# EAGLE schematic Stromlaufplan_v21 (EAGLE 9.7.0)
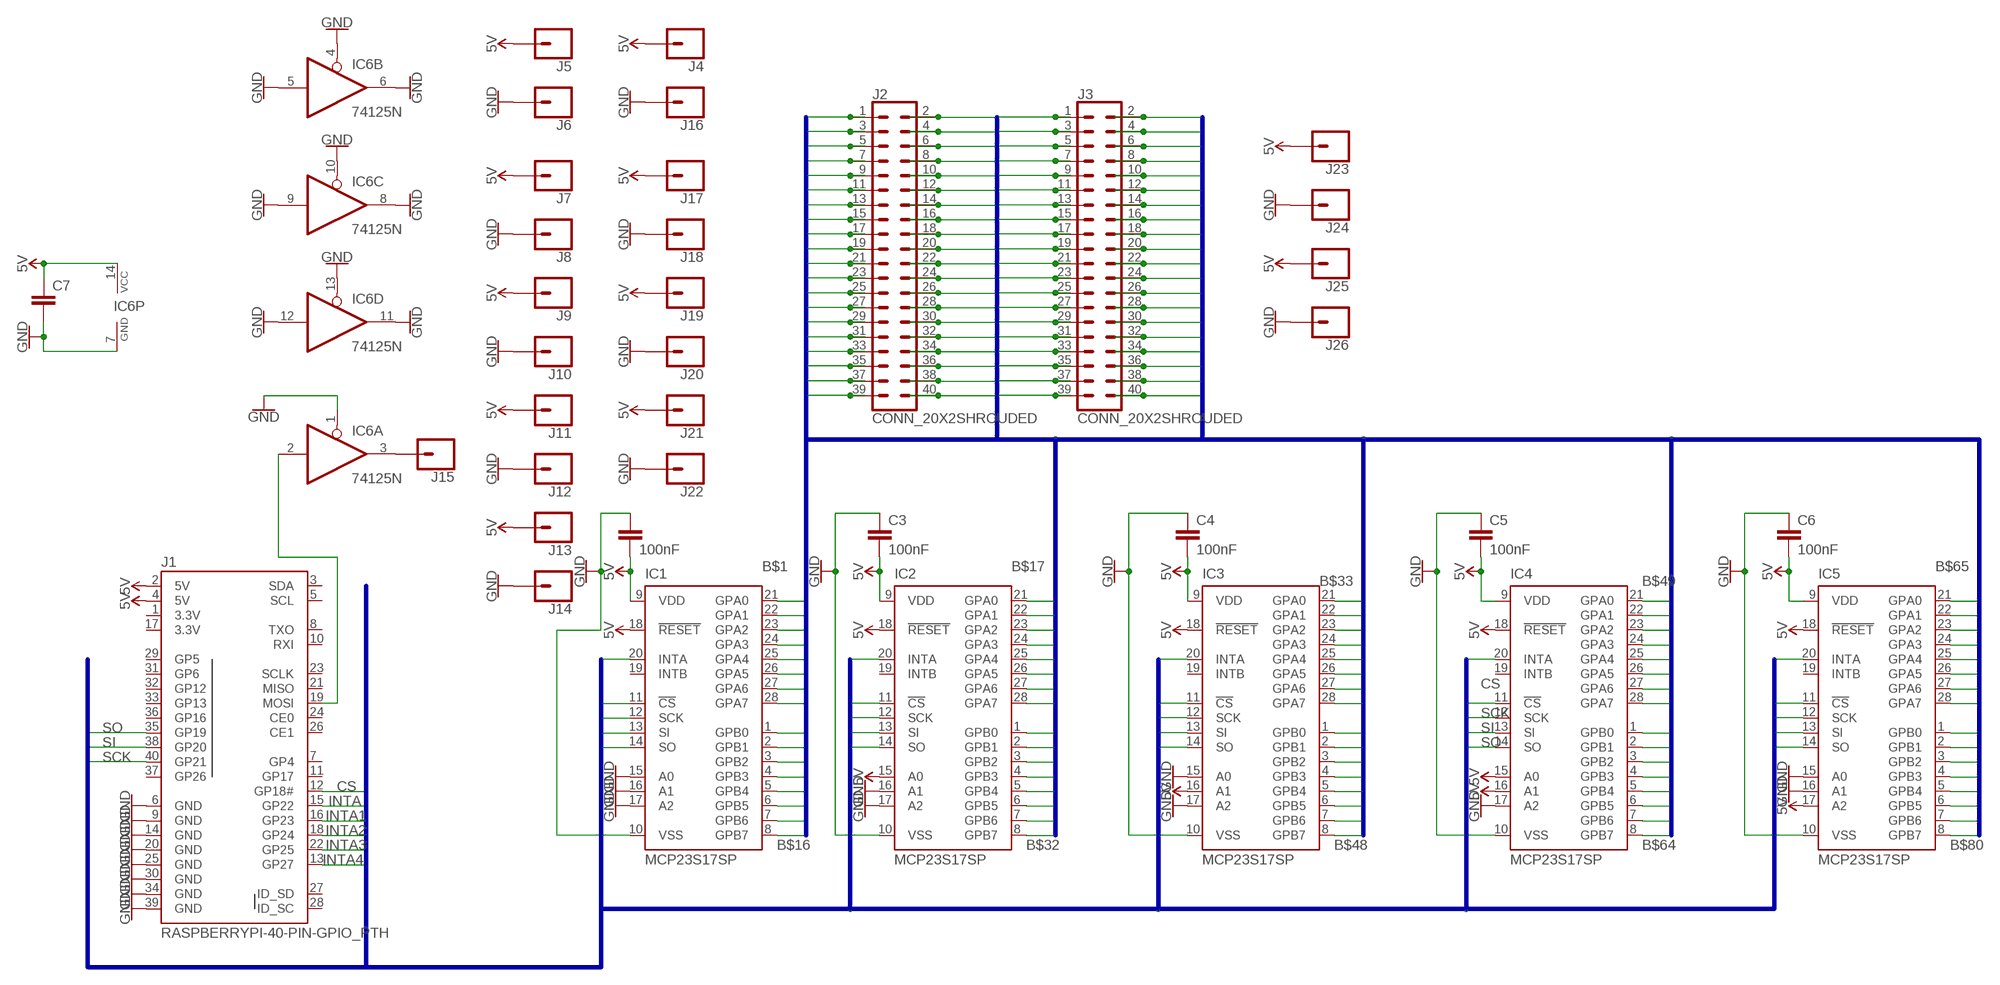
[diagram p0: schematic, sheet 1]

## Parts
C2  100nF  0.33UF/330NF-0805-50V-10%  [0805]
C3  100nF  0.33UF/330NF-0805-50V-10%  [0805]
C4  100nF  0.33UF/330NF-0805-50V-10%  [0805]
C5  100nF  0.33UF/330NF-0805-50V-10%  [0805]
C6  100nF  0.33UF/330NF-0805-50V-10%  [0805]
C7  100nF  0.33UF/330NF-0805-50V-10%  [0805]
IC1  MCP23S17SP  [DIL28-3]
IC2  MCP23S17SP  [DIL28-3]
IC3  MCP23S17SP  [DIL28-3]
IC4  MCP23S17SP  [DIL28-3]
IC5  MCP23S17SP  [DIL28-3]
IC6  74125N  [DIL14]
J1  RASPBERRYPI-40-PIN-GPIO_PTH  [2X20_SHROUDED]
J2  CONN_20X2SHROUDED  [2X20_SHROUDED]
J3  CONN_20X2SHROUDED  [2X20_SHROUDED]
J4  CONN_01PTH_NO_SILK_YES_STOP  [1X01_NO_SILK]
J5  CONN_01  [1X01]
J6  CONN_01  [1X01]
J7  CONN_01PTH_NO_SILK_YES_STOP  [1X01_NO_SILK]
J8  CONN_01PTH_NO_SILK_YES_STOP  [1X01_NO_SILK]
J9  CONN_01PTH_NO_SILK_YES_STOP  [1X01_NO_SILK]
J10  CONN_01PTH_NO_SILK_YES_STOP  [1X01_NO_SILK]
J11  CONN_01PTH_NO_SILK_YES_STOP  [1X01_NO_SILK]
J12  CONN_01PTH_NO_SILK_YES_STOP  [1X01_NO_SILK]
J13  CONN_01PTH_NO_SILK_YES_STOP  [1X01_NO_SILK]
J14  CONN_01PTH_NO_SILK_YES_STOP  [1X01_NO_SILK]
J15  CONN_01PTH_NO_SILK_YES_STOP  [1X01_NO_SILK]
J16  CONN_01PTH_NO_SILK_YES_STOP  [1X01_NO_SILK]
J17  CONN_01PTH_NO_SILK_YES_STOP  [1X01_NO_SILK]
J18  CONN_01PTH_NO_SILK_YES_STOP  [1X01_NO_SILK]
J19  CONN_01PTH_NO_SILK_YES_STOP  [1X01_NO_SILK]
J20  CONN_01PTH_NO_SILK_YES_STOP  [1X01_NO_SILK]
J21  CONN_01PTH_NO_SILK_YES_STOP  [1X01_NO_SILK]
J22  CONN_01PTH_NO_SILK_YES_STOP  [1X01_NO_SILK]
J23  CONN_01PTH_NO_SILK_YES_STOP  [1X01_NO_SILK]
J24  CONN_01PTH_NO_SILK_YES_STOP  [1X01_NO_SILK]
J25  CONN_01PTH_NO_SILK_YES_STOP  [1X01_NO_SILK]
J26  CONN_01PTH_NO_SILK_YES_STOP  [1X01_NO_SILK]

## Nets
5V: C2.2 C3.2 C4.2 C5.2 C6.2 C7.1 IC1.9(VDD) IC1.18(!RESET) IC2.9(VDD) IC2.15(A0) IC2.18(!RESET) IC3.9(VDD) IC3.16(A1) IC3.18(!RESET) IC4.9(VDD) IC4.15(A0) IC4.16(A1) IC4.18(!RESET) IC5.9(VDD) IC5.17(A2) IC5.18(!RESET) IC6.14(P:VCC) J1.2(5V) J1.4(5V) J4.1 J5.1 J7.1 J9.1 J11.1 J13.1 J17.1 J19.1 J21.1 J23.1 J25.1
B$1: IC1.21(GPA0) J2.1
B$2: IC1.22(GPA1) J2.2
B$3: IC1.23(GPA2) J2.3
B$4: IC1.24(GPA3) J2.4
B$5: IC1.25(GPA4) J2.5
B$6: IC1.26(GPA5) J2.6
B$7: IC1.27(GPA6) J2.7
B$8: IC1.28(GPA7) J2.8
B$9: IC1.1(GPB0) J2.9
B$10: IC1.2(GPB1) J2.10
B$11: IC1.3(GPB2) J2.11
B$12: IC1.4(GPB3) J2.12
B$13: IC1.5(GPB4) J2.13
B$14: IC1.6(GPB5) J2.14
B$15: IC1.7(GPB6) J2.15
B$16: IC1.8(GPB7) J2.16
B$17: IC2.21(GPA0) J2.17
B$18: IC2.22(GPA1) J2.18
B$19: IC2.23(GPA2) J2.19
B$20: IC2.24(GPA3) J2.20
B$21: IC2.25(GPA4) J2.21
B$22: IC2.26(GPA5) J2.22
B$23: IC2.27(GPA6) J2.23
B$24: IC2.28(GPA7) J2.24
B$25: IC2.1(GPB0) J2.25
B$26: IC2.2(GPB1) J2.26
B$27: IC2.3(GPB2) J2.27
B$28: IC2.4(GPB3) J2.28
B$29: IC2.5(GPB4) J2.29
B$30: IC2.6(GPB5) J2.30
B$31: IC2.7(GPB6) J2.31
B$32: IC2.8(GPB7) J2.32
B$33: IC3.21(GPA0) J2.33
B$34: IC3.22(GPA1) J2.34
B$35: IC3.23(GPA2) J2.35
B$36: IC3.24(GPA3) J2.36
B$37: IC3.25(GPA4) J2.37
B$38: IC3.26(GPA5) J2.38
B$39: IC3.27(GPA6) J2.39
B$40: IC3.28(GPA7) J2.40
B$41: IC3.1(GPB0) J3.1
B$42: IC3.2(GPB1) J3.2
B$43: IC3.3(GPB2) J3.3
B$44: IC3.4(GPB3) J3.4
B$45: IC3.5(GPB4) J3.5
B$46: IC3.6(GPB5) J3.6
B$47: IC3.7(GPB6) J3.7
B$48: IC3.8(GPB7) J3.8
B$49: IC4.21(GPA0) J3.9
B$50: IC4.22(GPA1) J3.10
B$51: IC4.23(GPA2) J3.11
B$52: IC4.24(GPA3) J3.12
B$53: IC4.25(GPA4) J3.13
B$54: IC4.26(GPA5) J3.14
B$55: IC4.27(GPA6) J3.15
B$56: IC4.28(GPA7) J3.16
B$57: IC4.1(GPB0) J3.17
B$58: IC4.2(GPB1) J3.18
B$59: IC4.3(GPB2) J3.19
B$60: IC4.4(GPB3) J3.20
B$61: IC4.5(GPB4) J3.21
B$62: IC4.6(GPB5) J3.22
B$63: IC4.7(GPB6) J3.23
B$64: IC4.8(GPB7) J3.24
B$65: IC5.21(GPA0) J3.25
B$66: IC5.22(GPA1) J3.26
B$67: IC5.23(GPA2) J3.27
B$68: IC5.24(GPA3) J3.28
B$69: IC5.25(GPA4) J3.29
B$70: IC5.26(GPA5) J3.30
B$71: IC5.27(GPA6) J3.31
B$72: IC5.28(GPA7) J3.32
B$73: IC5.1(GPB0) J3.33
B$74: IC5.2(GPB1) J3.34
B$75: IC5.3(GPB2) J3.35
B$76: IC5.4(GPB3) J3.36
B$77: IC5.5(GPB4) J3.37
B$78: IC5.6(GPB5) J3.38
B$79: IC5.7(GPB6) J3.39
B$80: IC5.8(GPB7) J3.40
CS: IC1.11(!CS) IC2.11(!CS) IC3.11(!CS) IC4.11(!CS) IC5.11(!CS) J1.12(GP18#)
GND: C2.1 C3.1 C4.1 C5.1 C6.1 C7.2 IC1.10(VSS) IC1.15(A0) IC1.16(A1) IC1.17(A2) IC2.10(VSS) IC2.16(A1) IC2.17(A2) IC3.10(VSS) IC3.15(A0) IC3.17(A2) IC4.10(VSS) IC4.17(A2) IC5.10(VSS) IC5.15(A0) IC5.16(A1) IC6.1(A:OE) IC6.4(B:OE) IC6.5(B:I) IC6.6(B:O) IC6.7(P:GND) IC6.8(C:O) IC6.9(C:I) IC6.10(C:OE) IC6.11(D:O) IC6.12(D:I) IC6.13(D:OE) J1.6(GND) J1.9(GND) J1.14(GND) J1.20(GND) J1.25(GND) J1.30(GND) J1.34(GND) J1.39(GND) J6.1 J8.1 J10.1 J12.1 J14.1 J16.1 J18.1 J20.1 J22.1 J24.1 J26.1
INTA: IC1.20(INTA) J1.15(GP22)
INTA1: IC2.20(INTA) J1.16(GP23)
INTA2: IC3.20(INTA) J1.18(GP24)
INTA3: IC4.20(INTA) J1.22(GP25)
INTA4: IC5.20(INTA) J1.13(GP27)
N$1: IC6.2(A:I) J1.19(MOSI)
N$2: IC6.3(A:O) J15.1
SCK: IC1.12(SCK) IC2.12(SCK) IC3.12(SCK) IC4.12(SCK) IC5.12(SCK) J1.40(GP21)
SI: IC1.13(SI) IC2.13(SI) IC3.13(SI) IC4.13(SI) IC5.13(SI) J1.38(GP20)
SO: IC1.14(SO) IC2.14(SO) IC3.14(SO) IC4.14(SO) IC5.14(SO) J1.35(GP19)
Unconnected: IC1.19(INTB) IC2.19(INTB) IC3.19(INTB) IC4.19(INTB) IC5.19(INTB) J1.3(SDA) J1.5(SCL) J1.7(GP4) J1.8(TXO) J1.10(RXI) J1.11(GP17) J1.21(MISO) J1.23(SCLK) J1.24(CE0) J1.26(CE1) J1.27(ID_SD) J1.28(ID_SC) J1.29(GP5) J1.31(GP6) J1.32(GP12) J1.33(GP13) J1.36(GP16) J1.37(GP26)

## Buses
CS,INTA,INTA1,INTA2,INTA3,INTA4,INTB,SCK,SI,SO,VDD,VSS
B$1,B$2,B$3,B$4,B$5,B$6,B$7,B$8,B$9,B$10,B$11,B$12,B$13,B$14,B$15,B$16,B$17,B$18,B$19,B$20,B$21,B$22,B$23,B$24,B$25,B$26,B$27,B$28,B$29,B$30,B$31,B$32,B$33,B$34,B$35,B$36,B$37,B$38,B$39,B$40,B$41,B$42,B$43,B$44,B$45,B$46,B$47,B$48,B$49,B$50,B$51,B$52,B$53,B$54,B$55,B$56,B$57,B$58,B$59,B$60,B$61,B$62,B$63,B$64,B$65,B$66,B$67,B$68,B$69,B$70,B$71,B$72,B$73,B$74,B$75,B$76,B$77,B$78,B$79,B$80

## Power pins joined to a net without a drawn wire
3.3V: J1.1(3.3V) J1.17(3.3V)

## Library data of the parts
C2-C7 = SparkFun-Capacitors:0.33UF/330NF: 0.33µF/330nF ceramic capacitors A capacitor is a passive two-terminal electrical component used to store electrical energy temporarily in an electric field.; PROD_ID: CAP-08469; VALUE: 0.33µF
IC1-IC5 = microchip:MCP23S17: http://ww1.microchip.com/downloads/en/DeviceDoc/21952a.pdf Source: http://ww1.microchip.com/downloads/en/DeviceDoc/21952a.pdf; MF: MICROCHIP; MPN: MCP23S17-E/SP; OC_FARNELL: 1292238; OC_NEWARK: 31K2951
IC6 = 74xx-eu:74*125: Quad bus BUFFER, 3-state
J1 = SparkFun-Connectors_Ladestation:RASPBERRYPI-40-PIN-GPIO: Raspberry Pi GPIO Header 2x20 pin connector, as found on B, B+, A+ models. Both shrouded PTH and SMT versions available. SparkFun Products: GPIO Shrouded Header <https://www.sparkfun.com/products/13054>- PTH SparkFun Pi Wedge (Preassembled) <https://www.sparkfun.com/products/13717>; PROD_ID: CONN-12263; SF_ID: PRT-13054
J2 J3 = SparkFun-Connectors_Ladestation:CONN_20X2: Multi connection point. Often used as Generic Header-pin footprint for 0.1 inch spaced/style header connections On any of the 0.1 inch spaced packages, you can populate with these: Break Away Headers - Straight <https://www.sparkfun.com/products/116> (PRT-00116) Break Away Male Headers - Right Angle <https://www.sparkfun.com/products/553> (PRT-00553) Female Headers <https://www.sparkfun.com/products/115> (PRT-00115) Break Away Headers - Machine Pin <https://www.sparkfun.com/products/117> (PRT-00117) Break Away Female Headers - Swiss Machine Pin <https://www.sparkfun.com/products/743> (PRT-00743); PROD_ID: CONN-12263; SF_ID: CONN-12263
J4-J26 = SparkFun-Connectors_Ladestation:CONN_01: Single connection point. Often used as Generic Header-pin footprint for 0.1 inch spaced/style header connections On any of the 0.1 inch spaced packages, you can populate with these: Break Away Headers - Straight <https://www.sparkfun.com/products/116> (PRT-00116) Break Away Male Headers - Right Angle <https://www.sparkfun.com/products/553> (PRT-00553) Female Headers <https://www.sparkfun.com/products/115> (PRT-00115) Break Away Headers - Machine Pin <https://www.sparkfun.com/products/117> (PRT-00117) Break Away Female Headers - Swiss Machine Pin <https://www.sparkfun.com/products/743> (PRT-00743) This device is also useful as a general connection point to wire up your design to another part of your project. Our various solder wires solder well into these plated through hole pads. Hook-Up Wire - Assortment (Stranded, 22 AWG) <https://www.sparkfun.com/products/11375> (PRT-11375) Hook-Up Wire - Assortment (Solid Core, 22 AWG) <https://www.sparkfun.com/products/11367> (PRT-11367) View the entire wire category on our website here <https://www.sparkfun.com/categories/141> Special notes: SMTSO-256-ET is a "flush mount" nut for a 4-40 screw. We mostly use this on specialty testbeds; it is a nice way to connect hardware to your PCB at an adjustable hieght. Also note, the SNAP packages are for using a snappable style connector. We sell a baggie of snaps and they are also used on two LilyPad designs: Snap Assortment - 30 pack (male and female) <https://www.sparkfun.com/products/11347> (DEV-11347) LilyPad Arduino SimpleSnap <https://www.sparkfun.com/products/10941> (DEV-10941) LilyPad SimpleSnap Protoboard <https://www.sparkfun.com/products/10940> (DEV-10940)